# EasyEDA Pro project ProPrj_stm32电赛单片机开发板_2025-02-17.epro, schematic Schematic1

## Sheets
1 主控: Board Name: Board1; Create Date: 2025-01-22; Page Name: 主控; Project Name: stm32电赛单片机开发板; Schematic Name: Schematic1; Update Date: 2025-02-03; Company: 嘉立创EDA; Page Size: A4; Version: V1.0
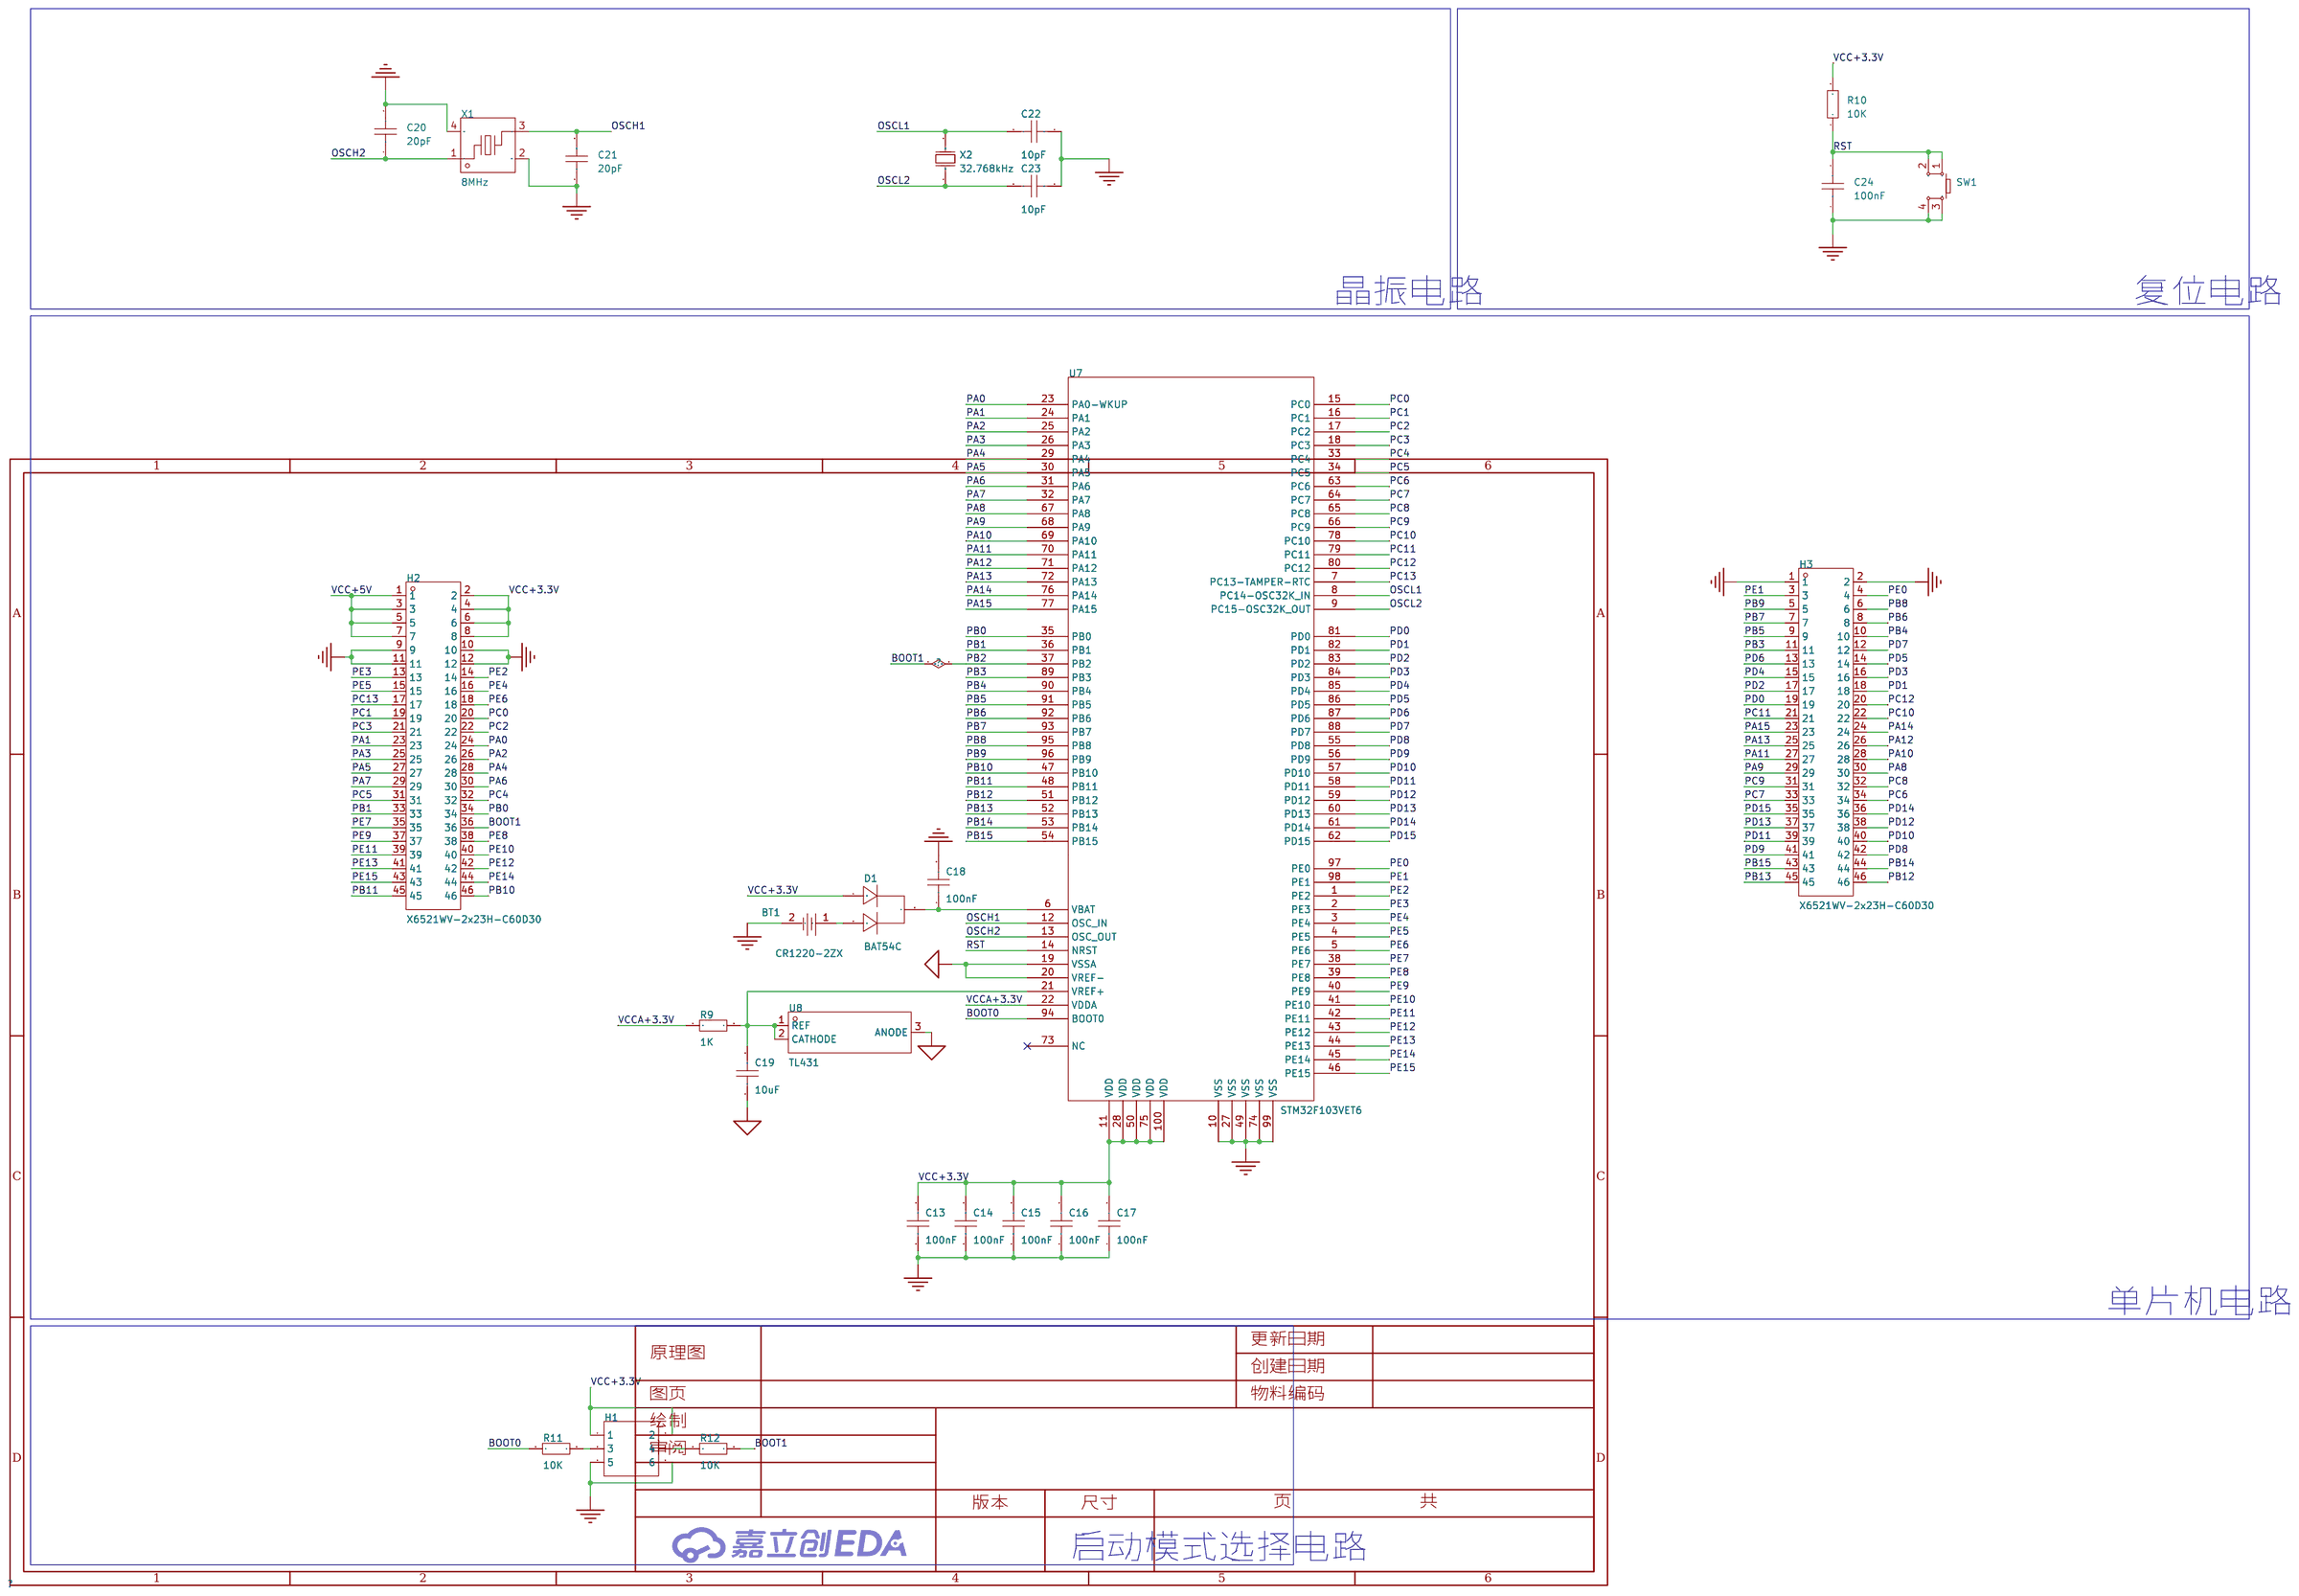
[diagram p0: 主控]
2 电源: Page Name: 电源; Update Date: 2025-02-04
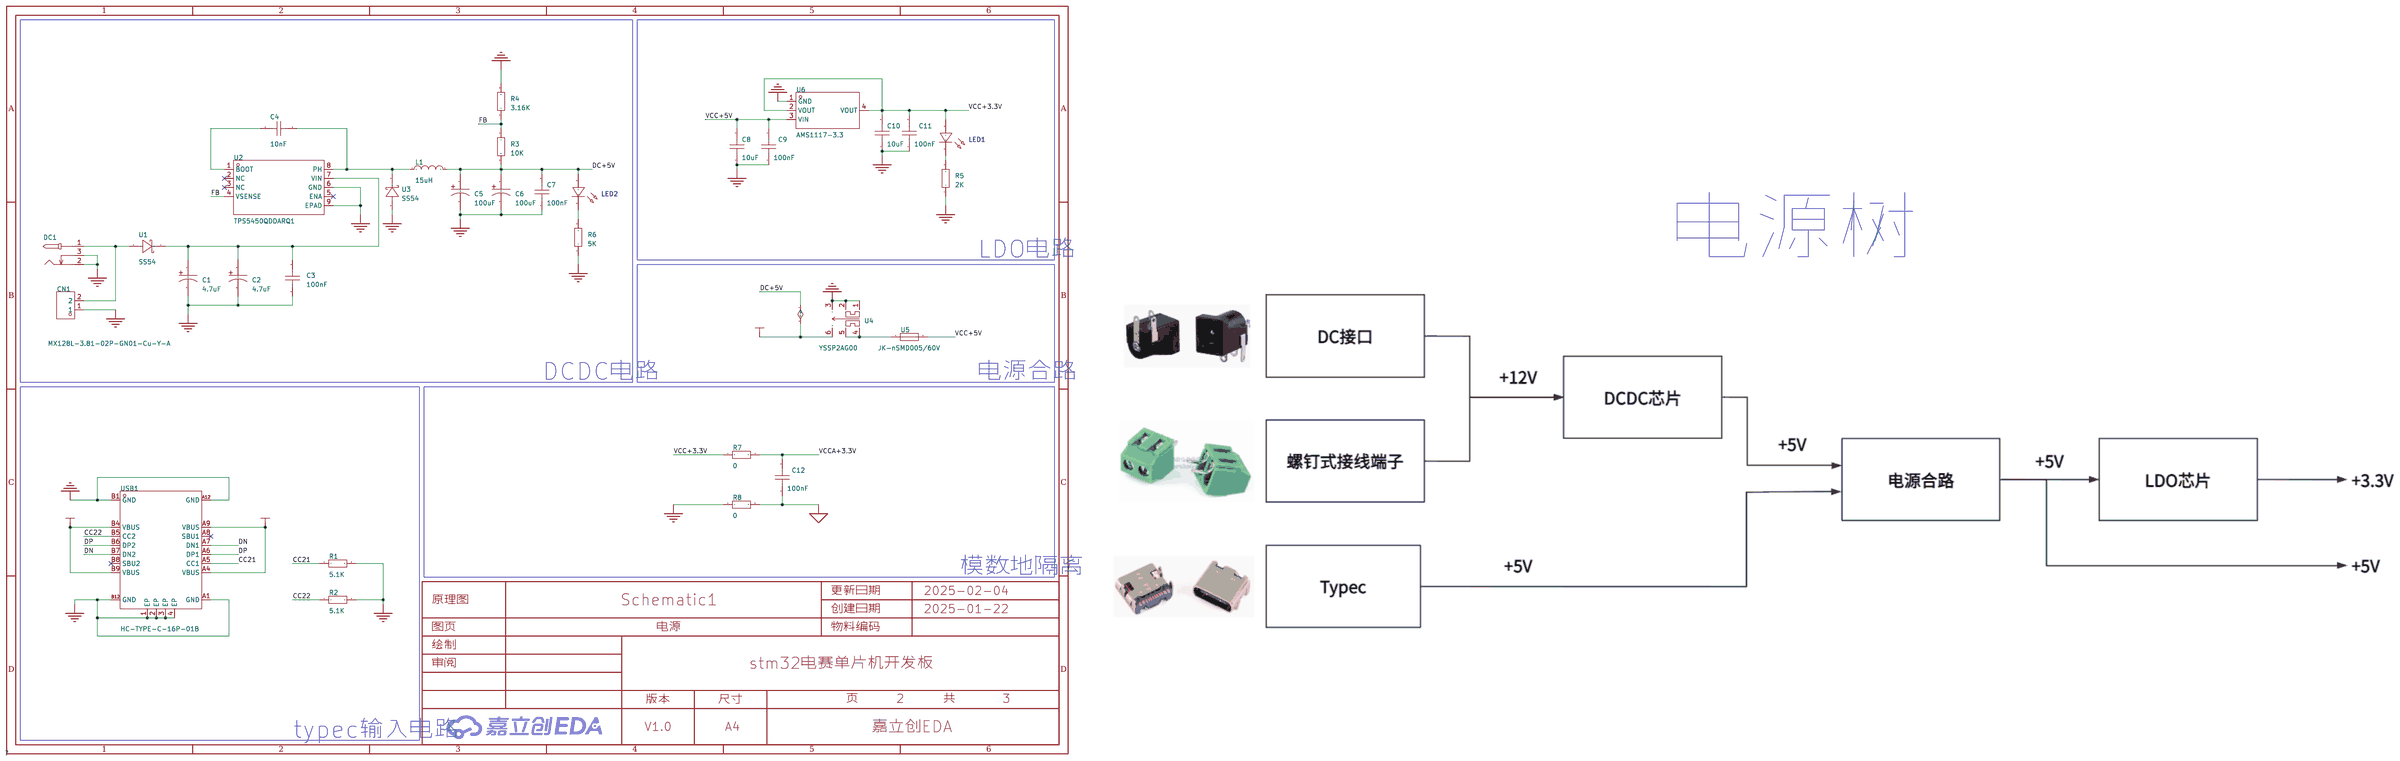
[diagram p1: 电源]
3 接口: Page Name: 接口; Update Date: 2025-02-04
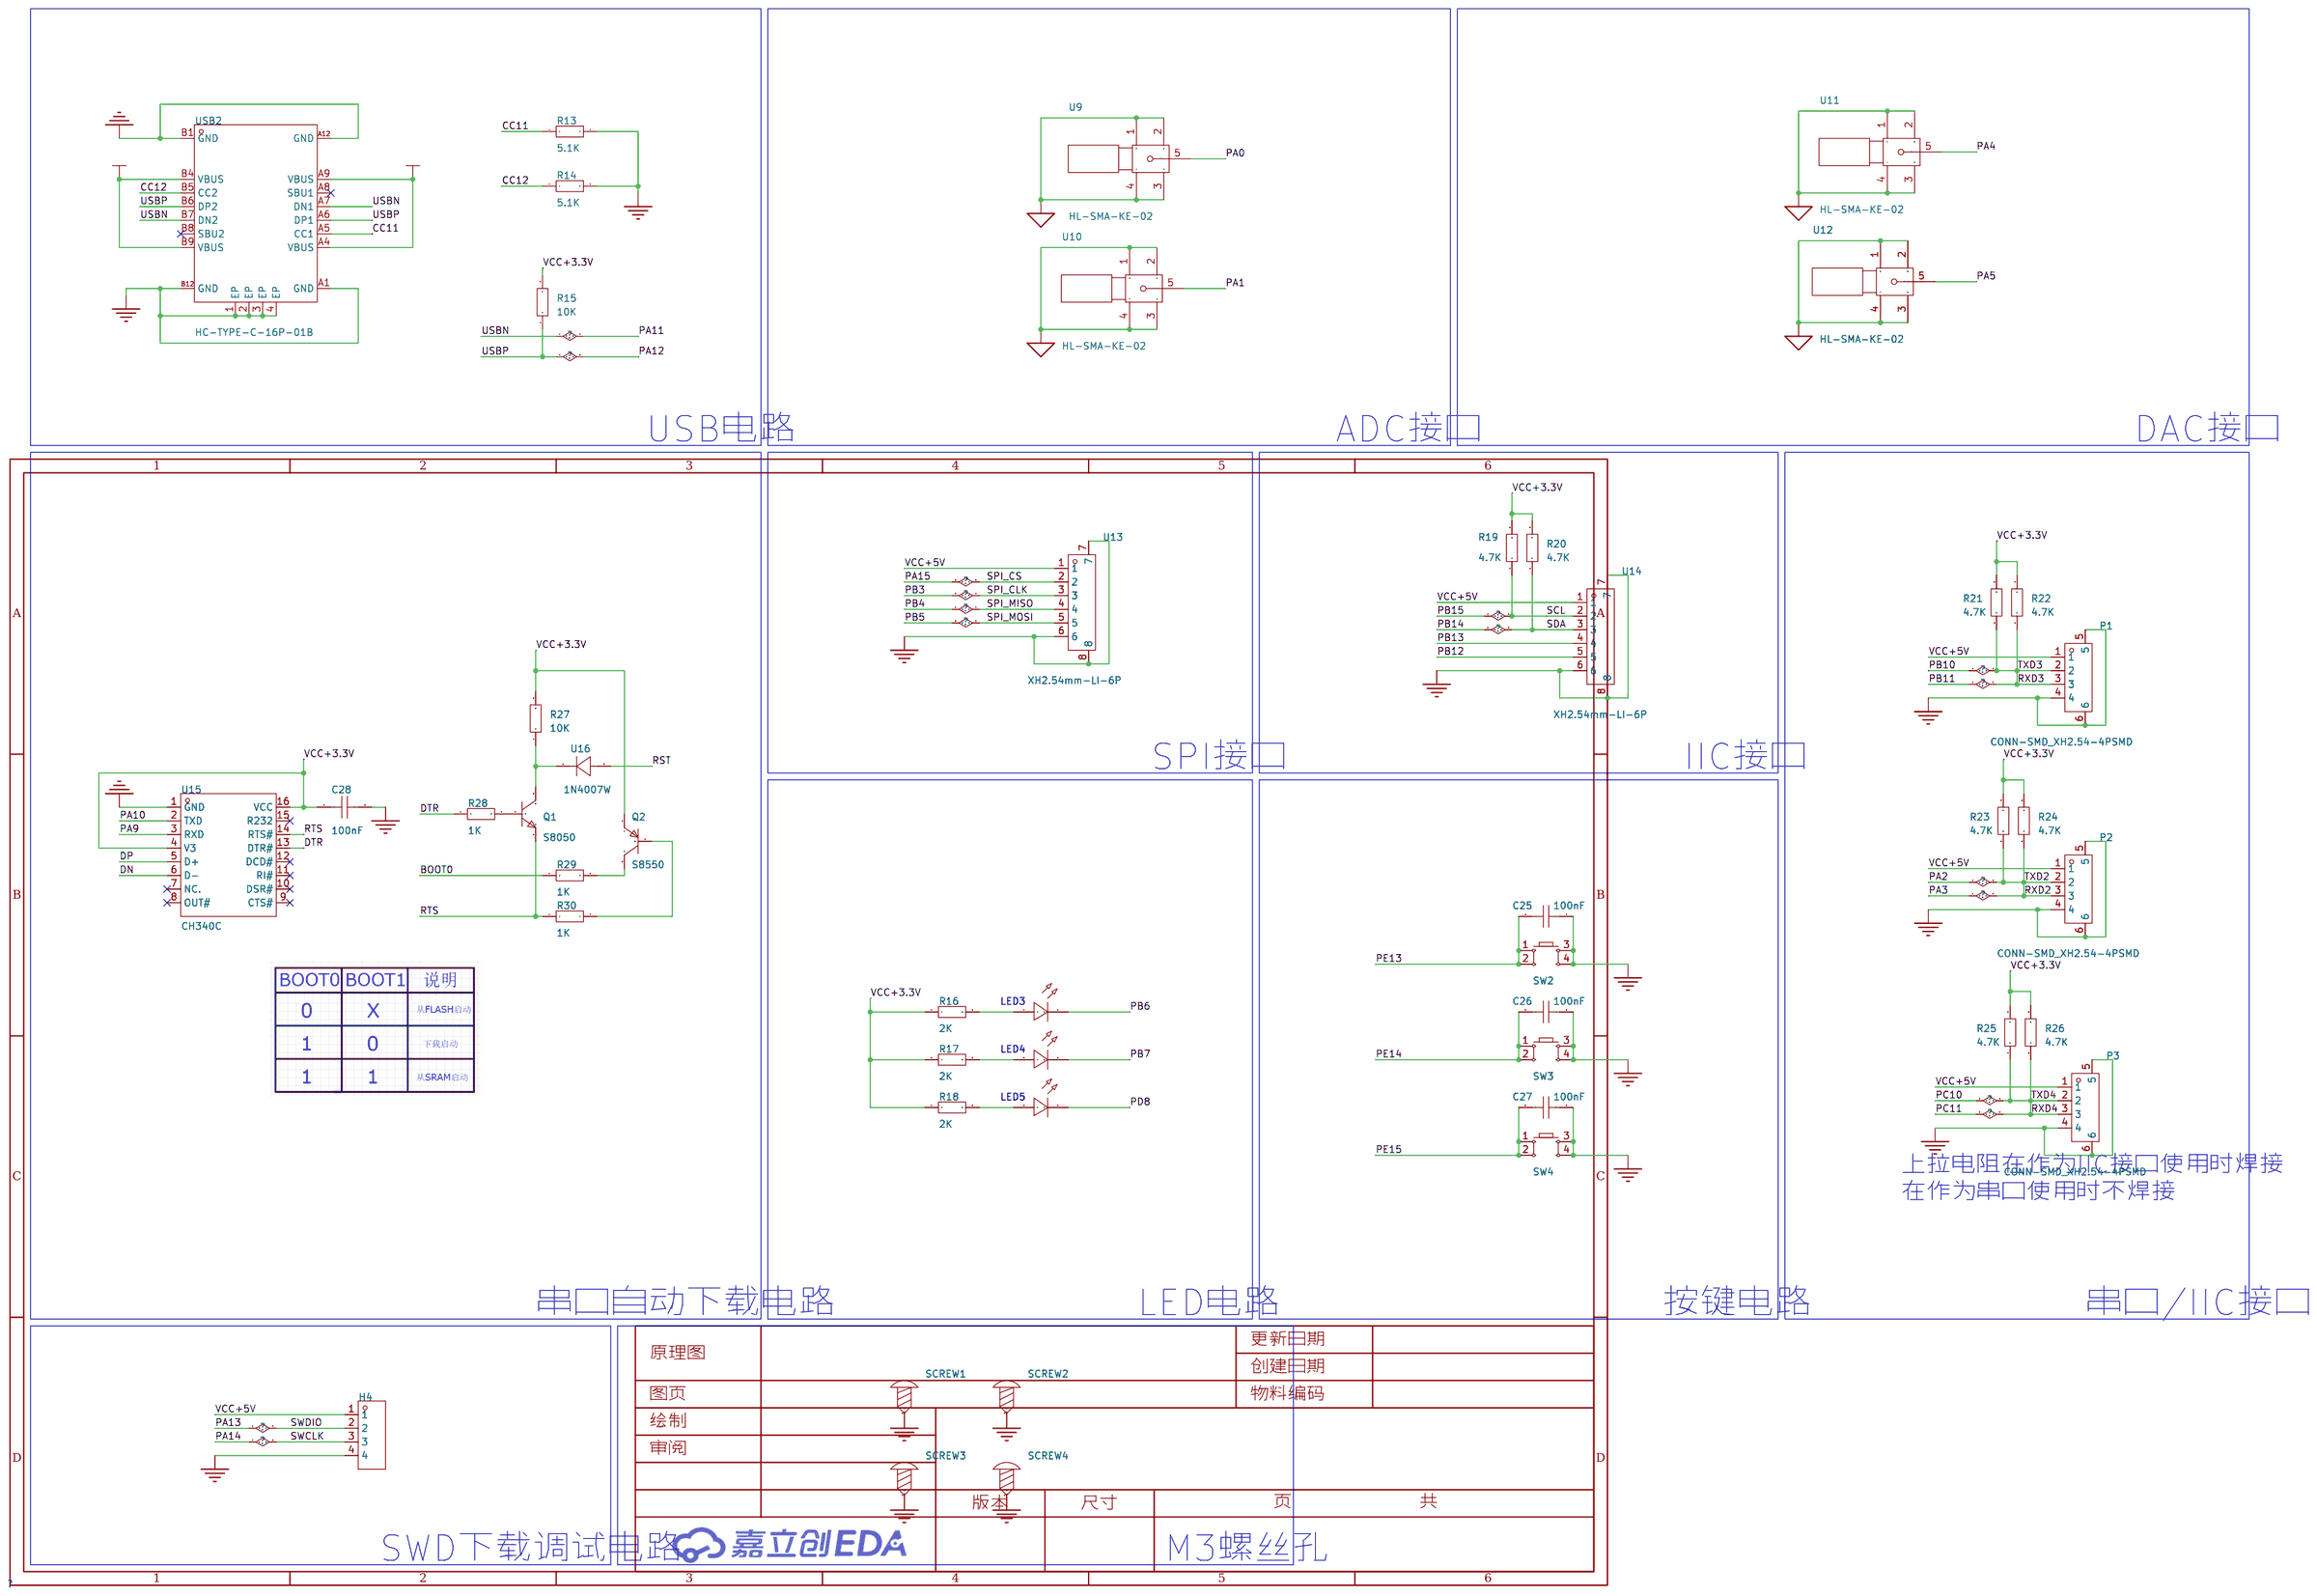
[diagram p2: 接口]

## Parts
sheet 主控
BT1  CR1220-2ZX  [BAT-SMD_CR1220-2ZX]
C13  100nF  [C0603]
C14  100nF  [C0603]
C15  100nF  [C0603]
C16  100nF  [C0603]
C17  100nF  [C0603]
C18  100nF  [C0603]
C19  10uF  [C0603]
C20  20pF  [C0603]
C21  20pF  [C0603]
C22  10pF  [C0603]
C23  10pF  [C0603]
C24  100nF  [C0603]
D1  BAT54C  [SOT-23-3_L2.9-W1.3-P1.90-LS2.4-BR]
H1  -  [HDR-TH_6P-P2.54-V-R2-C3-S2.54_A2541WV-2X3P]
H2  X6521WV-2x23H-C60D30  [HDR-TH_46P-2.54-V-M-R2-C23-S2.54]
H3  X6521WV-2x23H-C60D30  [HDR-TH_46P-2.54-V-M-R2-C23-S2.54]
R9  1K  [R0603]
R10  10K  [R0603]
R11  10K  [R0603]
R12  10K  [R0603]
SW1  -  [SW-SMD_4P-L6.0-W6.0-P4.50-LS9.0-2]
U7  STM32F103VET6  [LQFP-100_L14.0-W14.0-P0.50-LS16.0-BL]
U8  TL431  [SOT-23-3_L2.9-W1.3-P1.90-LS2.4-BR]
X1  8MHz  [CRYSTAL-SMD_4P-L3.2-W2.5-BL_SIT8008BI]
X2  32.768kHz  [OSC-SMD_L3.2-W1.5]
sheet 接口
C25  100nF  [C0603]
C26  100nF  [C0603]
C27  100nF  [C0603]
C28  100nF  [C0603]
H4  -  [HDR-TH_4P-P2.54-V-M]
LED3  -  [LED_0603]
LED4  -  [LED_0603]
LED5  -  [LED_0603]
P1  CONN-SMD_XH2.54-4PSMD  [CONN-SMD_XH2.54-4PSMD]
P2  CONN-SMD_XH2.54-4PSMD  [CONN-SMD_XH2.54-4PSMD]
P3  CONN-SMD_XH2.54-4PSMD  [CONN-SMD_XH2.54-4PSMD]
Q1  S8050  [SOT-23-3_L2.9-W1.3-P1.90-LS2.4-BR]
Q2  S8550  [SOT-23-3_L2.9-W1.3-P1.90-LS2.4-BR]
R13  5.1K  [R0603]
R14  5.1K  [R0603]
R15  10K  [R0603]
R16  2K  [R0603]
R17  2K  [R0603]
R18  2K  [R0603]
R19  4.7K  [R0603]
R20  4.7K  [R0603]
R21  4.7K  [R0603]
R22  4.7K  [R0603]
R23  4.7K  [R0603]
R24  4.7K  [R0603]
R25  4.7K  [R0603]
R26  4.7K  [R0603]
R27  10K  [R0603]
R28  1K  [R0603]
R29  1K  [R0603]
R30  1K  [R0603]
SCREW1  -  [M3螺丝]
SCREW2  -  [M3螺丝]
SCREW3  -  [M3螺丝]
SCREW4  -  [M3螺丝]
SW2  -  [SW-SMD_4P-L6.0-W6.0-P4.50-LS9.0-2]
SW3  -  [SW-SMD_4P-L6.0-W6.0-P4.50-LS9.0-2]
SW4  -  [SW-SMD_4P-L6.0-W6.0-P4.50-LS9.0-2]
U9  HL-SMA-KE-02  [SMA-TH_HL-SMA-KHD2]
U10  HL-SMA-KE-02  [SMA-TH_HL-SMA-KHD2]
U11  HL-SMA-KE-02  [SMA-TH_HL-SMA-KHD2]
U12  HL-SMA-KE-02  [SMA-TH_HL-SMA-KHD2]
U13  XH2.54mm-LI-6P  [CONN-SMD_6P-P2.50-H]
U14  XH2.54mm-LI-6P  [CONN-SMD_6P-P2.50-H]
U15  CH340C  [SOP-16_L10.0-W3.9-P1.27-LS6.0-BL]
U16  1N4007W  [SOD-123FL_L2.7-W1.8-LS3.7-RD]
USB2  HC-TYPE-C-16P-01B  [USB-C-SMD_KH-TYPE-C-16P]
sheet 电源
C1  4.7uF  [CAP-SMD_BD5.0-L5.3-W5.3-FD]
C2  4.7uF  [CAP-SMD_BD5.0-L5.3-W5.3-FD]
C3  100nF  [C0603]
C4  10nF  [C0603]
C5  100uF  [CAP-SMD_BD5.0-L5.3-W5.3-FD]
C6  100uF  [CAP-SMD_BD5.0-L5.3-W5.3-FD]
C7  100nF  [C0603]
C8  10uF  [C0603]
C9  100nF  [C0603]
C10  10uF  [C0603]
C11  100nF  [C0603]
C12  100nF  [C0603]
CN1  MX128L-3.81-02P-GN01-Cu-Y-A  [CONN-TH_2P-P3.81_MX128L-3.81-GN01-02P-CU-Y-A]
DC1  -  [DC-005_2.5]
L1  15uH  [IND-SMD_L7.3-W6.6]
LED1  -  [LED_0603]
LED2  -  [LED_0603]
R1  5.1K  [R0603]
R2  5.1K  [R0603]
R3  10K  [R0603]
R4  3.16K  [R0603]
R5  2K  [R0603]
R6  5K  [R0603]
R7  0  [R0603]
R8  0  [R0603]
U1  SS54  [SMA_L4.2-W2.6-LS5.1-RD]
U2  TPS5450QDDARQ1  [SOIC-8_L4.9-W3.9-P1.27-LS6.0-BL-EP]
U3  SS54  [SMA_L4.2-W2.6-LS5.1-RD]
U4  YSSP2AG00  [SW-SMD_YSSP2AG00]
U5  JK-nSMD005/60V  [F1206]
U6  AMS1117-3.3  [SOT-223-3_L6.5-W3.4-P2.30-LS7.0-BR]
USB1  HC-TYPE-C-16P-01B  [USB-C-SMD_KH-TYPE-C-16P]

## Library data of the parts
BT1 = CR1220-2ZX: 连接器类型:电池底座;适用电池规格:CR1220;工作温度范围:-25℃~+85℃;; Supplier Part: C969906; Manufacturer: Q&J; Supplier Footprint: SMD; JLCPCB Part Class: 扩展库; Datasheet: https://atta.szlcsc.com/upload/public/pdf/source/20210107/C969906_C1D85B5C66CBBA4D1AEB8467FE1CEC7A.pdf; Supplier: LCSC; Connector Type: 电池底座; Battery Type: CR1220; Operating Temperature Range: -25℃~+85℃
C3 C4 C7-C28 = CAP_0603: Supplier Footprint: 0603
D1 = BAT54C: Supplier Part: C9900013520; Supplier Footprint: SOT-23; Supplier: LCSC
H1 = HDR-M_2.54_2x3: Supplier Part: C402781; Supplier Footprint: 插件,P=2.54mm; JLCPCB Part Class: 扩展库
H2 H3 = X6521WV-2x23H-C60D30: 插针结构:2x23P;间距:2.54mm;行距:2.54mm;圆针/方针:方针;安装类型:-;排数:双排;总PIN位数:46P;额定电流:3A;额定电压:250V;配合针长度:-;塑高:2.5mm;端接针长度:-;触头材质:黄铜;触头镀层:金;工作温度范围:-40℃~+105℃;颜色:黑色;; LCSC Part Name: 2x23P 间距:2.54mm 方针; Supplier Part: C725895; Manufacturer: XKB Connection(中国星坤); Supplier Footprint: 插件,P=2.54mm; JLCPCB Part Class: 扩展库; Datasheet: https://atta.szlcsc.com/upload/public/pdf/source/20230411/57A4E57F780B9AEBD628250EB464E1CC.pdf; Supplier: LCSC; Pin Structure: 2x23P; Pitch: 2.54mm; Row Spacing: 2.54mm; Circluar Pins/Square Pins: 方针; Number of Rows: 双排; Number of Pins: 46P; Current Rating (Max): 3A; Voltage Rating (Max): 250V; Insulation Height: 2.5mm; Contact Material: 黄铜; Contact Plating: 金; Operating Temperature Range: -40℃~+105℃; Color: 黑色
R1-R30 = Res_0603: Supplier Footprint: 0603
SW1-SW4 = Key_SMD_6x6x6.5: Supplier Footprint: SMD
U7 = STM32F103VET6: CPU内核:ARM-M3;CPU最大主频:72MHz;应用领域:-;; LCSC Part Name: 主流增强型ARM Cortex-M3 MCU，具有512 KB Flash、72 MHz CPU、电机控制、USB和CAN; Supplier Part: C8308; Manufacturer: ST(意法半导体); Supplier Footprint: LQFP-100(14x14); JLCPCB Part Class: 扩展库; Datasheet: https://atta.szlcsc.com/upload/public/pdf/source/20191104/C443969_BBB78F97FCB1C210242AC41DD2A995A0.pdf; Supplier: LCSC; CPU Core: ARM-M3; CPU Maximum Speed: 72MHz; Program Storage Size: 512KB; Program Memory Type: FLASH; Number of I/O: 80; ADC (Bit): 12bit; DAC (Bit): 12bit; Low Voltage Detection Threshold: 2V~3.6V
U8 = TL431: Supplier Part: C2887585; Manufacturer: YFSEMI(江苏佑风微); Supplier Footprint: SOT-23; JLCPCB Part Class: 扩展库; Datasheet: https://atta.szlcsc.com/upload/public/pdf/source/20211230/94EA76606731071F336A0C78CD912A4F.pdf; Supplier: LCSC
X1 = XL2EL89CSI-111YLC-8M: 晶振类型:贴片晶振;频率:8MHz;常温频差:±10ppm;外接负载电容:20pF;频率稳定度(全温):±20ppm;; LCSC Part Name: 8MHz ±10ppm 20pF; Supplier Part: C5444548; Manufacturer: YXC(扬兴晶振); Supplier Footprint: SMD3225-4P; JLCPCB Part Class: 扩展库; Datasheet: https://atta.szlcsc.com/upload/public/pdf/source/20240329/19D5F850207469550BEB00D7DFEDBC7A.pdf; Supplier: LCSC; Crystal Type: 贴片晶振; Normal temperature Frequency Tolerance: ±10ppm; External load capacitor: 20pF; Frequency Stability(Full temperature range): ±20ppm; Operating Temperature: -40℃~+85℃
X2 = SF32WK32768D31T002: 晶振类型:-;频率:-;外接负载电容:-;; LCSC Part Name: 3215  32.768KHZ  12.5PF  ±20PPM  -40℃~+85℃; Supplier Part: C271654; Manufacturer: TKD(泰晶); Supplier Footprint: SMD3215-2P; JLCPCB Part Class: 扩展库; Datasheet: https://atta.szlcsc.com/upload/public/pdf/source/20210414/C271654_9FD726E46D0A9E6DACC0E569C8E3A63B.pdf; Supplier: LCSC
H4 = HDR-M_2.54_1x4P: Supplier Part: C492403; Supplier Footprint: 插件; JLCPCB Part Class: 扩展库
LED1-LED5 = LED_0603-G: Supplier Footprint: 0603
P1-P3 = CONN-SMD_XH2.54-4PSMD: Supplier Part: C9900018341; Supplier Footprint: CONN-SMD-4P; JLCPCB Part Class: 扩展库; Supplier: LCSC
Q1 = S8050: NPN 25V 500mA 120-400 SOT-23; Supplier Part: C2931719; Manufacturer: Doeshare(德芯); Supplier Footprint: SOT-23; JLCPCB Part Class: 扩展库; Datasheet: https://atta.szlcsc.com/upload/public/pdf/source/20220117/E6D3315E0D6ADDB25840BFFAC039C5C0.pdf; Supplier: LCSC
Q2 = S8550: LCSC Part Name: PNP -25V -500mA 120-400 SOT-23; Supplier Part: C2931720; Manufacturer: Doeshare(德芯); Supplier Footprint: SOT-23; JLCPCB Part Class: 扩展库; Datasheet: https://atta.szlcsc.com/upload/public/pdf/source/20220104/15A23F6542E365B9E2BA018BE45092B6.pdf; Supplier: LCSC
SCREW1-SCREW4 = M3螺丝: Supplier Footprint: 插件
U9-U12 = HL-SMA-KE-02: 连接器类型:板端;接口类型:内孔;端口数量:1;接口直径:5.3mm;接口长度/高度:8mm;频率-最大值:6GHz;射频系列:SMA;阻抗:50Ω;样式:-;触头材质:黄铜;触头镀层:金;工作温度范围:-55℃~+125℃;焊接温度(最大值):260℃;; LCSC Part Name: 内孔 SMA SMA母头PCB安装直式 内孔; Supplier Part: C20617215; Manufacturer: HenryTech(恒利泰); Supplier Footprint: 插件; Datasheet: https://atta.szlcsc.com/upload/public/pdf/source/20240202/E85161E00FF1335BC5A77C3514648B77.pdf; Supplier: LCSC; Connector Type: 板端; Interface Type: 内孔; Number of Ports: 1; Interface Diameter: 5.3mm; Interface Length/Height: 8mm; Frequency-Max: 6GHz; RF Series: SMA; Impedance: 50Ω; Contact Material: 黄铜; Contact Plating: 金; Operating Temperature Range: -55℃~+125℃; Soldering Temperature(Max): 260℃
U13 U14 = XH2.54mm-LI-6P: Supplier Part: C2842318; Supplier Footprint: SMD-6_7.8X17.5X2.5P; JLCPCB Part Class: 扩展库; Supplier: LCSC
U15 = CH340C: 应用功能:收发器;接口协议:USB 2.0;数据速率:2Mbps;; LCSC Part Name: CH340C USB转串口芯片 CH340; Supplier Part: C84681; Manufacturer: WCH(南京沁恒); Supplier Footprint: SOP-16; JLCPCB Part Class: 扩展库; Datasheet: https://atta.szlcsc.com/upload/public/pdf/source/20240619/63986D8440D4E5267A77ACD891CC4DE3.pdf; Supplier: LCSC; Applications Function: 收发器; Protocol: USB 2.0; Supply Voltage: 3.3V；5V; Data Rate: 2Mbps
U16 = 1N4007W_C7528871: 二极管配置:独立式;正向压降(Vf):1.1V@1A;直流反向耐压(Vr):1kV;整流电流:1A;; LCSC Part Name: 电压:1kV 电流:1A; Supplier Part: C7528871; Manufacturer: MSKSEMI(美森科); Supplier Footprint: SOD-123FL; JLCPCB Part Class: 扩展库; Datasheet: https://atta.szlcsc.com/upload/public/pdf/source/20230821/E9E7B8A13216AEAB33D679873610DFE6.pdf; Supplier: LCSC; Diode Configuration: 独立式; Forward Voltage (Vf@If): 1.1V@1A; Reverse Voltage (Vr): 1kV; Rectified Current: 1A
USB1 USB2 = HC-TYPE-C-16P-01B: 连接器类型:Type-C;标准:-;公母:母;端口数量:1;触点数量:16P;安装方式:卧贴;额定电流 - 电源:3A;触头材质:铜;触头镀层:金;工作温度范围:-25℃~+85℃;焊接温度(最大值):260℃;; LCSC Part Name: Type-C 母 卧贴; Supplier Part: C2894898; Manufacturer: HCTL(华灿天禄); Supplier Footprint: SMD; JLCPCB Part Class: 扩展库; Datasheet: https://atta.szlcsc.com/upload/public/pdf/source/20221116/A0A1FBB0E7A834DC9555AEBAA987625F.pdf; Supplier: LCSC; Connector Type: Type-C; Gender: 母; Number of Ports: 1; Number of Contacts: 16P; Mounting Style: 卧贴; Current Rating - Power (Max): 3A; Contact Material: 铜; Contact Plating: 金; Operating Temperature Range: -25℃~+85℃; Soldering Temperature(Max): 260℃
C1 C2 C5 C6 = EMVE500ADA4R7ME55G: 容值:4.7uF;精度:±20%;额定电压:50V;纹波电流:20mA@120Hz;等效串联电阻:-;; LCSC Part Name: 4.7uF ±20% 50V; Supplier Part: C178270; Manufacturer: NCC(日本贵弥功); Supplier Footprint: SMD,D5xL5.2mm; JLCPCB Part Class: 扩展库; Datasheet: https://atta.szlcsc.com/upload/public/pdf/source/20180530/C178280_3EF6968EAC9B0F0D2B2AB76FB03ACC1C.pdf; Supplier: LCSC; Tolerance: ±20%; Rated Voltage: 50V; Ripple Current: 20mA@120Hz; φD: 5mm; L: 5.2mm; Lifetime @ Temp: 1000hrs@105℃; Operating Temperature: -40℃~+105℃
CN1 = MX128L-3.81-02P-GN01-Cu-Y-A: 结构:1x2P;间距:3.81mm;颜色:绿色;安装方式:直插;排数:1;每排PIN数:2;额定电流:10A;额定电压:150V;线规 - AWG:16~26;线规 - 平方毫米:1.5;工作温度范围:-40℃~+105℃;; LCSC Part Name: 1x2P 3.81mm 直插 排数:1 每排P数:2; Supplier Part: C5188452; Manufacturer: MAX(迈旭); Supplier Footprint: 插件,P=3.81mm; JLCPCB Part Class: 扩展库; Datasheet: https://atta.szlcsc.com/upload/public/pdf/source/20230914/B6D11694B2EF123065C24316748628EB.pdf; Supplier: LCSC; Structure: 1x2P; Pitch: 3.81mm; Color: 绿色; Mounting Style: 直插; Number of Pins: 2P; Number of Rows: 1; Number of PINs Per Row: 2; Screw Specification: M2; Current Rating (Max): 10A; Voltage Rating (Max): 150V; Wire Gauge - AWG: 16~26; Wire Gauge - mm2: 1.5; Operating Temperature Range: -40℃~+105℃
DC1 = DC-005_2.5: Supplier Footprint: 插件
L1 = 10uH/5A7*7mm一体成型电感: Supplier Part: C9900022584; JLCPCB Part Class: 扩展库; Supplier: LCSC
U1 U3 = SS54: Supplier Part: C9900023219; Supplier Footprint: (1N5824)DO-214; JLCPCB Part Class: 扩展库; Supplier: LCSC
U2 = TPS5450QDDARQ1: 功能类型:降压型;输出类型:可调;工作电压:5.5V~36V;输出电压:1.221V~32.04V;输出电流:5A;; LCSC Part Name: 5A宽输入范围降压转换器; Supplier Part: C181270; Manufacturer: TI(德州仪器); Supplier Footprint: SOIC-8-EP; JLCPCB Part Class: 扩展库; Datasheet: https://www.ti.com/cn/lit/gpn/tps5450-q1; Supplier: LCSC; Function: 降压型; Output Type: 可调; Input Voltage: 5.5V~36V; Output Voltage: 1.221V~32.04V; Output Current: 5A; Switching Frequency: 500kHz; Operating Temperature: -40℃~+125℃@(TJ); Synchronous Rectification: 否; Number of Outputs: 1; Topology: 降压式; Switch tube (built-in/external): 内置
U4 = YSSP2AG00: LCSC Part Name: 9x3.6 正按6脚贴片滑动开关; Supplier Part: C5188558; Manufacturer: YIYUAN(怡远); Supplier Footprint: SMD; JLCPCB Part Class: 扩展库; Datasheet: https://atta.szlcsc.com/upload/public/pdf/source/20221011/AF6FF47B5A85181594B051FD518E9363.pdf; Supplier: LCSC
U5 = JK-nSMD005/60V: 最大电压:60V;最大电流:100A;保持电流:50mA;跳闸电流:150mA;; LCSC Part Name: 60V 0.05A 1206自恢复; Supplier Part: C2830235; Manufacturer: JK(金科); Supplier Footprint: 1206; JLCPCB Part Class: 扩展库; Datasheet: https://atta.szlcsc.com/upload/public/pdf/source/20210427/C2830251_B9511B640A50AD6A91174E2DDDD254CA.pdf; Supplier: LCSC; Operating Voltage (Max): 60V; Current Rating (Max): 100A; Hold Current: 50mA; Trip Current: 150mA; Resistance - Initial (Ri) (Min): 3.6Ω; Resistance - Post Trip (R1) (Max): 50Ω; Maximum Time to Trip: 1.5s; Operating Temperature: -40℃~+85℃
U6 = AMS1117-3.3_C6186: 输出类型:固定;最大输入电压:-;输出电压:3.3V;最大输出电流:1A;电源纹波抑制比(PSRR):72dB@(120Hz);输出极性:正极;; LCSC Part Name: 输出3.3V 1A; Supplier Part: C6186; Manufacturer: AMS; Supplier Footprint: SOT-223; JLCPCB Part Class: 基础库; Datasheet: https://atta.szlcsc.com/upload/public/pdf/source/20180727/C6186_7A095716F0823C02F1997A905E26C086.pdf; Supplier: LCSC; Output Type: 固定; Output Voltage: 3.3V; MAX Output Current: 1A; Power Supply Rejection Ratio (PSRR): 72dB@(120Hz); Dropout Voltage: 1.3V@(800mA); Output Polarity: 正极; Number of Outputs: 1

## Nets
AGND: C12.1 C19.1 R8.2 U7.19(VSSA) U7.20(VREF-) U8.3(ANODE) U9.1 U9.2 U9.3 U9.4 U10.1 U10.2 U10.3 U10.4 U11.1 U11.2 U11.3 U11.4 U12.1 U12.2 U12.3 U12.4
GND: BT1.2 C1.2 C2.2 C3.1 C5.2 C6.2 C7.1 C8.1 C9.1 C10.1 C11.1 C13.1 C14.1 C15.1 C16.1 C17.1 C18.2 C20.2 C21.1 C22.1 C23.1 C24.1 C25.1 C26.1 C27.1 C28.2 CN1.1 DC1.2 DC1.3 H1.5 H1.6 H2.9 H2.10 H2.11 H2.12 H3.1 H3.2 H4.4 P1.4 P1.5 P1.6 P2.4 P2.5 P2.6 P3.4 P3.5 P3.6 R1.2 R2.2 R4.2 R5.1 R6.1 R8.1 R13.2 R14.2 SCREW1.1 SCREW2.1 SCREW3.1 SCREW4.1 SW1.3 SW1.4 SW2.3 SW2.4 SW3.3 SW3.4 SW4.3 SW4.4 U2.6(GND) U2.9(EPAD) U3.2(A) U4.1 U4.2 U4.3 U6.1(GND) U7.10(VSS) U7.27(VSS) U7.49(VSS) U7.74(VSS) U7.99(VSS) U13.6 U13.7 U13.8 U14.6 U14.7 U14.8 U15.1(GND) USB1.1(EP) USB1.2(EP) USB1.3(EP) USB1.4(EP) USB1.A1(GND) USB1.A12(GND) USB1.B1(GND) USB1.B12(GND) USB2.1(EP) USB2.2(EP) USB2.3(EP) USB2.4(EP) USB2.A1(GND) USB2.A12(GND) USB2.B1(GND) USB2.B12(GND) X1.2(GND) X1.4(GND)
VCC+3.3V: C10.2 C11.2 C13.2 C14.2 C15.2 C16.2 C17.2 C28.1 D1.1(A1) H1.1 H1.2 H2.2 H2.4 H2.6 H2.8 LED1.2(A) Q2.2(E) R7.1 R10.2 R15.2 R16.1 R17.1 R18.1 R19.2 R20.2 R21.2 R22.2 R23.2 R24.2 R25.2 R26.2 R27.2 U6.2(VOUT) U6.4(VOUT) U7.11(VDD) U7.28(VDD) U7.50(VDD) U7.75(VDD) U7.100(VDD) U15.4(V3) U15.16(VCC)
VCC+5V: C8.2 C9.2 H2.1 H2.3 H2.5 H2.7 H4.1 P1.1 P2.1 P3.1 U5.2 U6.3(VIN) U13.1 U14.1
VCCA+3.3V: C12.2 R7.2 R9.1 U7.22(VDDA)
BOOT0: R11.1 R29.1 U7.94(BOOT0)
BOOT1: H2.36 R12.2 U7.37(PB2)
CC11: R13.1 USB2.A5(CC1)
CC12: R14.1 USB2.B5(CC2)
CC21: R1.1 USB1.A5(CC1)
CC22: R2.1 USB1.B5(CC2)
DN: U15.6(D-) USB1.A7(DN1) USB1.B7(DN2)
DP: U15.5(D+) USB1.A6(DP1) USB1.B6(DP2)
DTR: R28.1 U15.13(DTR#)
FB: R3.1 R4.1 U2.4(VSENSE)
OSCH1: C21.2 U7.12(OSC_IN) X1.3
OSCH2: C20.1 U7.13(OSC_OUT) X1.1
OSCL1: C22.2 U7.8(PC14-OSC32K_IN) X2.2(OSC2)
OSCL2: C23.2 U7.9(PC15-OSC32K_OUT) X2.1(OSC1)
PA0: H2.24 U7.23(PA0-WKUP) U9.5
PA1: H2.23 U7.24(PA1) U10.5
PA2: H2.26 P2.2 R23.1 U7.25(PA2)
PA3: H2.25 P2.3 R24.1 U7.26(PA3)
PA4: H2.28 U7.29(PA4) U11.5
PA5: H2.27 U7.30(PA5) U12.5
PA6: H2.30 U7.31(PA6)
PA7: H2.29 U7.32(PA7)
PA8: H3.30 U7.67(PA8)
PA9: H3.29 U7.68(PA9) U15.3(RXD)
PA10: H3.28 U7.69(PA10) U15.2(TXD)
PA11: H3.27 U7.70(PA11) USB2.A7(DN1) USB2.B7(DN2)
PA12: H3.26 R15.1 U7.71(PA12) USB2.A6(DP1) USB2.B6(DP2)
PA13: H3.25 H4.2 U7.72(PA13)
PA14: H3.24 H4.3 U7.76(PA14)
PA15: H3.23 U7.77(PA15) U13.2
PB0: H2.34 U7.35(PB0)
PB1: H2.33 U7.36(PB1)
PB3: H3.11 U7.89(PB3) U13.3
PB4: H3.10 U7.90(PB4) U13.4
PB5: H3.9 U7.91(PB5) U13.5
PB6: H3.8 LED3.1(C) U7.92(PB6)
PB7: H3.7 LED4.1(C) U7.93(PB7)
PB8: H3.6 U7.95(PB8)
PB9: H3.5 U7.96(PB9)
PB10: H2.46 P1.2 R21.1 U7.47(PB10)
PB11: H2.45 P1.3 R22.1 U7.48(PB11)
PB12: H3.46 U7.51(PB12) U14.5
PB13: H3.45 U7.52(PB13) U14.4
PB14: H3.44 R20.1 U7.53(PB14) U14.3
PB15: H3.43 R19.1 U7.54(PB15) U14.2
PC0: H2.20 U7.15(PC0)
PC1: H2.19 U7.16(PC1)
PC2: H2.22 U7.17(PC2)
PC3: H2.21 U7.18(PC3)
PC4: H2.32 U7.33(PC4)
PC5: H2.31 U7.34(PC5)
PC6: H3.34 U7.63(PC6)
PC7: H3.33 U7.64(PC7)
PC8: H3.32 U7.65(PC8)
PC9: H3.31 U7.66(PC9)
PC10: H3.22 P3.2 R25.1 U7.78(PC10)
PC11: H3.21 P3.3 R26.1 U7.79(PC11)
PC12: H3.20 U7.80(PC12)
PC13: H2.17 U7.7(PC13-TAMPER-RTC)
PD0: H3.19 U7.81(PD0)
PD1: H3.18 U7.82(PD1)
PD2: H3.17 U7.83(PD2)
PD3: H3.16 U7.84(PD3)
PD4: H3.15 U7.85(PD4)
PD5: H3.14 U7.86(PD5)
PD6: H3.13 U7.87(PD6)
PD7: H3.12 U7.88(PD7)
PD8: H3.42 LED5.1(C) U7.55(PD8)
PD9: H3.41 U7.56(PD9)
PD10: H3.40 U7.57(PD10)
PD11: H3.39 U7.58(PD11)
PD12: H3.38 U7.59(PD12)
PD13: H3.37 U7.60(PD13)
PD14: H3.36 U7.61(PD14)
PD15: H3.35 U7.62(PD15)
PE0: H3.4 U7.97(PE0)
PE1: H3.3 U7.98(PE1)
PE2: H2.14 U7.1(PE2)
PE3: H2.13 U7.2(PE3)
PE4: H2.16 U7.3(PE4)
PE5: H2.15 U7.4(PE5)
PE6: H2.18 U7.5(PE6)
PE7: H2.35 U7.38(PE7)
PE8: H2.38 U7.39(PE8)
PE9: H2.37 U7.40(PE9)
PE10: H2.40 U7.41(PE10)
PE11: H2.39 U7.42(PE11)
PE12: H2.42 U7.43(PE12)
PE13: C25.2 H2.41 SW2.1 SW2.2 U7.44(PE13)
PE14: C26.2 H2.44 SW3.1 SW3.2 U7.45(PE14)
PE15: C27.2 H2.43 SW4.1 SW4.2 U7.46(PE15)
RST: C24.2 R10.1 SW1.1 SW1.2 U7.14(NRST) U16.2(A)
RTS: Q1.2(E) R30.1 U15.14(RTS#)
USB+5V: C5.1 C6.1 C7.2 L1.2 LED2.2(A) R3.2 U4.6 USB1.A4(VBUS) USB1.A9(VBUS) USB1.B4(VBUS) USB1.B9(VBUS) USB2.A4(VBUS) USB2.A9(VBUS) USB2.B4(VBUS) USB2.B9(VBUS)
$1N1478: BT1.1 D1.2(A2)
$1N1482: C18.1 D1.3(K) U7.6(VBAT)
$1N1974: C19.2 R9.2 U7.21(VREF+) U8.1(REF) U8.2(CATHODE)
$1N3287: H1.3 R11.2
$1N3292: H1.4 R12.1
$2N821: CN1.2 DC1.1(4) U1.2(A)
$2N1087: C1.1 C2.1 C3.2 U1.1(C) U2.7(VIN)
$2N1523: C4.2 L1.1 U2.8(PH) U3.1(C)
$2N1532: C4.1 U2.1(BOOT)
$2N2883: LED1.1(C) R5.2
$2N2994: LED2.1(C) R6.2
$2N6141: U4.4 U4.5 U5.1
$3N1280: LED5.2(A) R18.2
$3N1284: LED4.2(A) R17.2
$3N1289: LED3.2(A) R16.2
$3N3983: Q1.3(C) R27.1 U16.1(K)
$3N4018: Q1.1(B) R28.2
$3N4022: Q2.1(B) R30.2
$3N4028: Q2.3(C) R29.2

Not connected (* = marked no-connect by the designer): U2 2(NC)* 3(NC)* 5(ENA)*; U7 73(NC)*; U15 7(NC.)* 8(OUT#)* 9(CTS#)* 10(DSR#)* 11(RI#)* 12(DCD#)* 15(R232)*; USB1 A8(SBU1)* B8(SBU2)*; USB2 A8(SBU1)* B8(SBU2)*

## Notes on the sheets
sheet 1
- 晶振电路
- 复位电路
- 单片机电路
- 启动模式选择电路
sheet 2
- LDO电路
- 电源树
- DCDC电路
- 电源合路
- 模数地隔离
- typec输入电路
sheet 3
- USB电路
- ADC接口
- DAC接口
- SPI接口
- IIC接口
- 上拉电阻在作为IIC接口使用时焊接
  在作为串口使用时不焊接
- 串口自动下载电路
- LED电路
- 按键电路
- 串口/IIC接口
- SWD下载调试电路
- M3螺丝孔
